# EAGLE design DACADC (EAGLE 6.2)
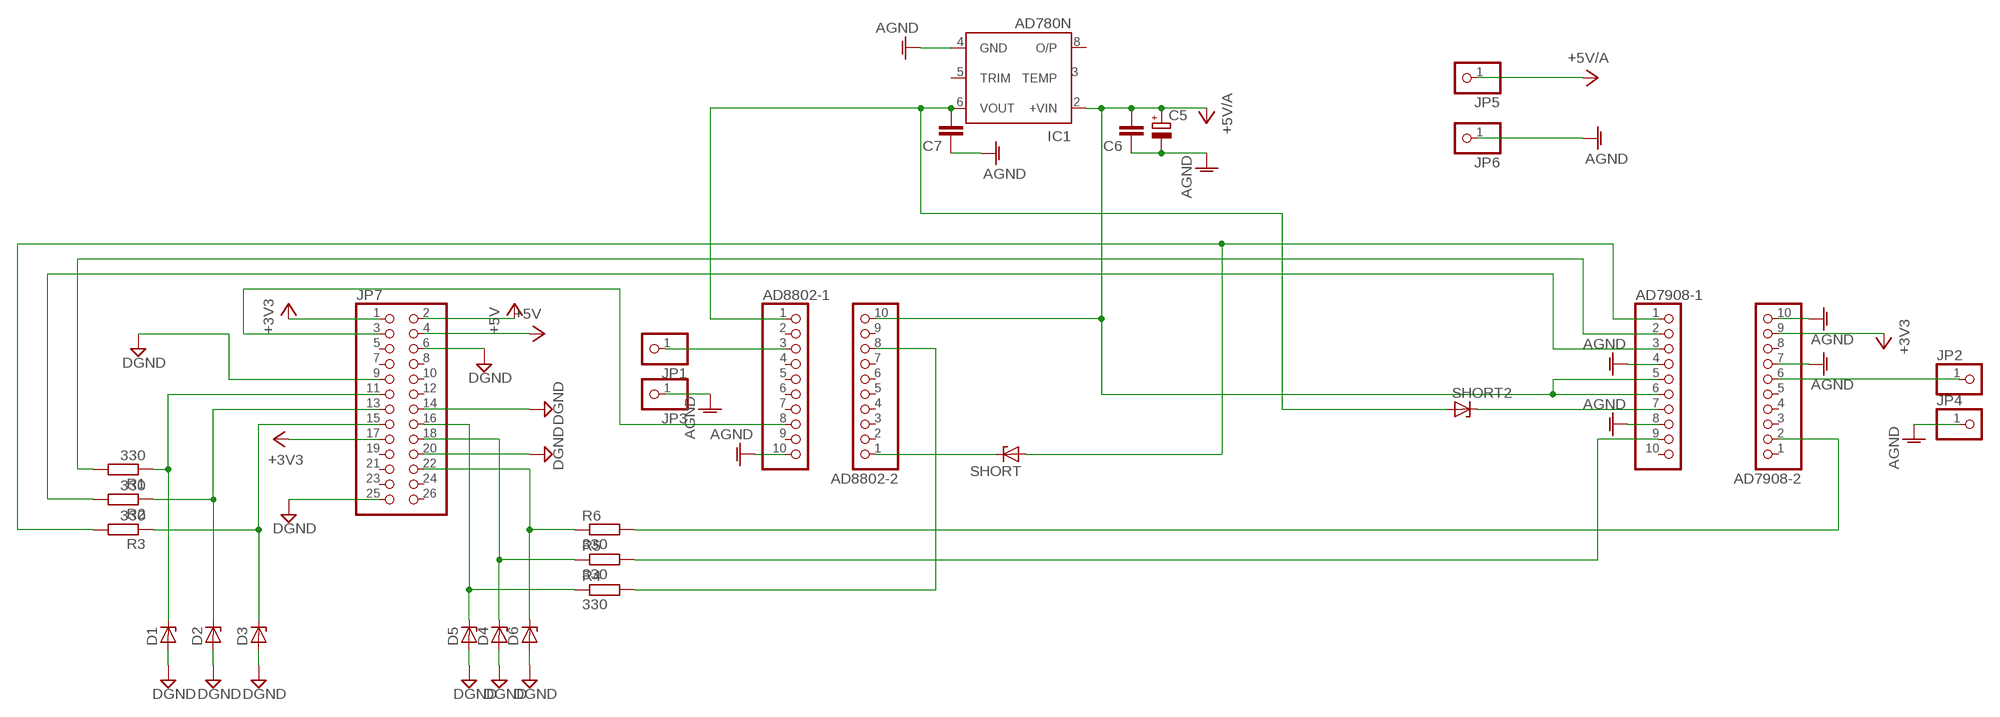
[diagram p0: schematic, sheet 1]

## Parts
AD7908-1  PINHD-1X10  [1X10]
AD7908-2  PINHD-1X10  [1X10]
AD8802-1  PINHD-1X10  [1X10]
AD8802-2  PINHD-1X10  [1X10]
C5  CPOL-EUE2.5-5  [E2,5-5]
C6  C-EU025-030X050  [C025-030X050]
C7  C-EU025-030X050  [C025-030X050]
D1  ZENER-DIODEDO34-7  [DO34Z7]
D2  ZENER-DIODEDO34-7  [DO34Z7]
D3  ZENER-DIODEDO34-7  [DO34Z7]
D4  ZENER-DIODEDO34-7  [DO34Z7]
D5  ZENER-DIODEDO34-7  [DO34Z7]
D6  ZENER-DIODEDO34-7  [DO34Z7]
IC1  AD780N  [DIL08]
JP1  PINHD-1X1  [1X01]
JP2  PINHD-1X1  [1X01]
JP3  PINHD-1X1  [1X01]
JP4  PINHD-1X1  [1X01]
JP5  PINHD-1X1  [1X01]
JP6  PINHD-1X1  [1X01]
JP7  PINHD-2X13  [2X13]
R1  330  R-EU_0204/5  [0204/5]
R2  330  R-EU_0204/5  [0204/5]
R3  330  R-EU_0204/5  [0204/5]
R4  330  R-EU_0204/5  [0204/5]
R5  330  R-EU_0204/5  [0204/5]
R6  330  R-EU_0204/5  [0204/5]
SHORT  ZENER-DIODEDO34-7  [DO34Z7]
SHORT2  ZENER-DIODEDO34-7  [DO34Z7]

## Nets
+3V3: AD7908-2.9 JP7.1 JP7.17
+5V: JP7.2 JP7.4
+5V/A: AD7908-1.5 AD7908-1.6 AD8802-2.10 C5.+ C6.2 JP5.1
AGND: AD7908-1.4 AD7908-1.8 AD7908-2.7 AD7908-2.10 AD8802-1.10 C5.- C6.1 C7.1 IC1.4(GND) JP3.1 JP4.1 JP6.1
DGND: D1.A D2.A D3.A D4.A D5.A D6.A JP7.6 JP7.9 JP7.14 JP7.20 JP7.25
N$1: D2.C JP7.13 R2.1
N$2: D3.C JP7.15 R3.1
N$3: D6.C JP7.22 R6.1
N$4: D4.C JP7.18 R5.1
N$5: D5.C JP7.16 R4.1
N$6: AD7908-1.2 R1.2
N$7: AD7908-1.7 SHORT2.C
N$8: AD7908-1.1 R3.2 SHORT.A
N$9: AD7908-1.3 R2.2
N$10: AD8802-2.8 R4.2
N$11: AD7908-1.9 R5.2
N$12: AD7908-2.2 R6.2
N$13: AD8802-1.1 C7.2 IC1.6(VOUT) SHORT2.A
N$14: AD7908-2.6 JP2.1
N$15: AD8802-1.3 JP1.1
N$16: AD8802-1.8 JP7.3
N$17: D1.C JP7.11 R1.1
N$18: AD8802-2.1 SHORT.C
Unconnected: AD7908-1.10 AD7908-2.1 AD7908-2.3 AD7908-2.4 AD7908-2.5 AD7908-2.8 AD8802-1.2 AD8802-1.4 AD8802-1.5 AD8802-1.6 AD8802-1.7 AD8802-1.9 AD8802-2.2 AD8802-2.3 AD8802-2.4 AD8802-2.5 AD8802-2.6 AD8802-2.7 AD8802-2.9 IC1.2(+VIN) IC1.3(TEMP) IC1.5(TRIM) IC1.8(O/P) JP7.5 JP7.7 JP7.8 JP7.10 JP7.12 JP7.19 JP7.21 JP7.23 JP7.24 JP7.26

## Library data of the parts
AD7908-1 AD7908-2 AD8802-1 AD8802-2 = pinhead:PINHD-1X10: PIN HEADER
C5 = rcl:CPOL-EU: POLARIZED CAPACITOR, European symbol
C6 C7 = rcl:C-EU: CAPACITOR, European symbol
D1-D6 SHORT SHORT2 = diode:ZENER-DIODE: Z-Diode
IC1 = analog-devices:AD780: High Precision Reference 2.5V/3.0V Source: http://www.analog.com/UploadedFiles/Data_Sheets/AD780.pdf; MF: ALTERA CORPORATION; MPN: AD780ANZ; OC_FARNELL: 9605550; OC_NEWARK: 59K5478
JP1-JP6 = pinhead:PINHD-1X1: PIN HEADER
JP7 = pinhead:PINHD-2X13: PIN HEADER
R1-R6 = rcl:R-EU_: RESISTOR, European symbol

## Board
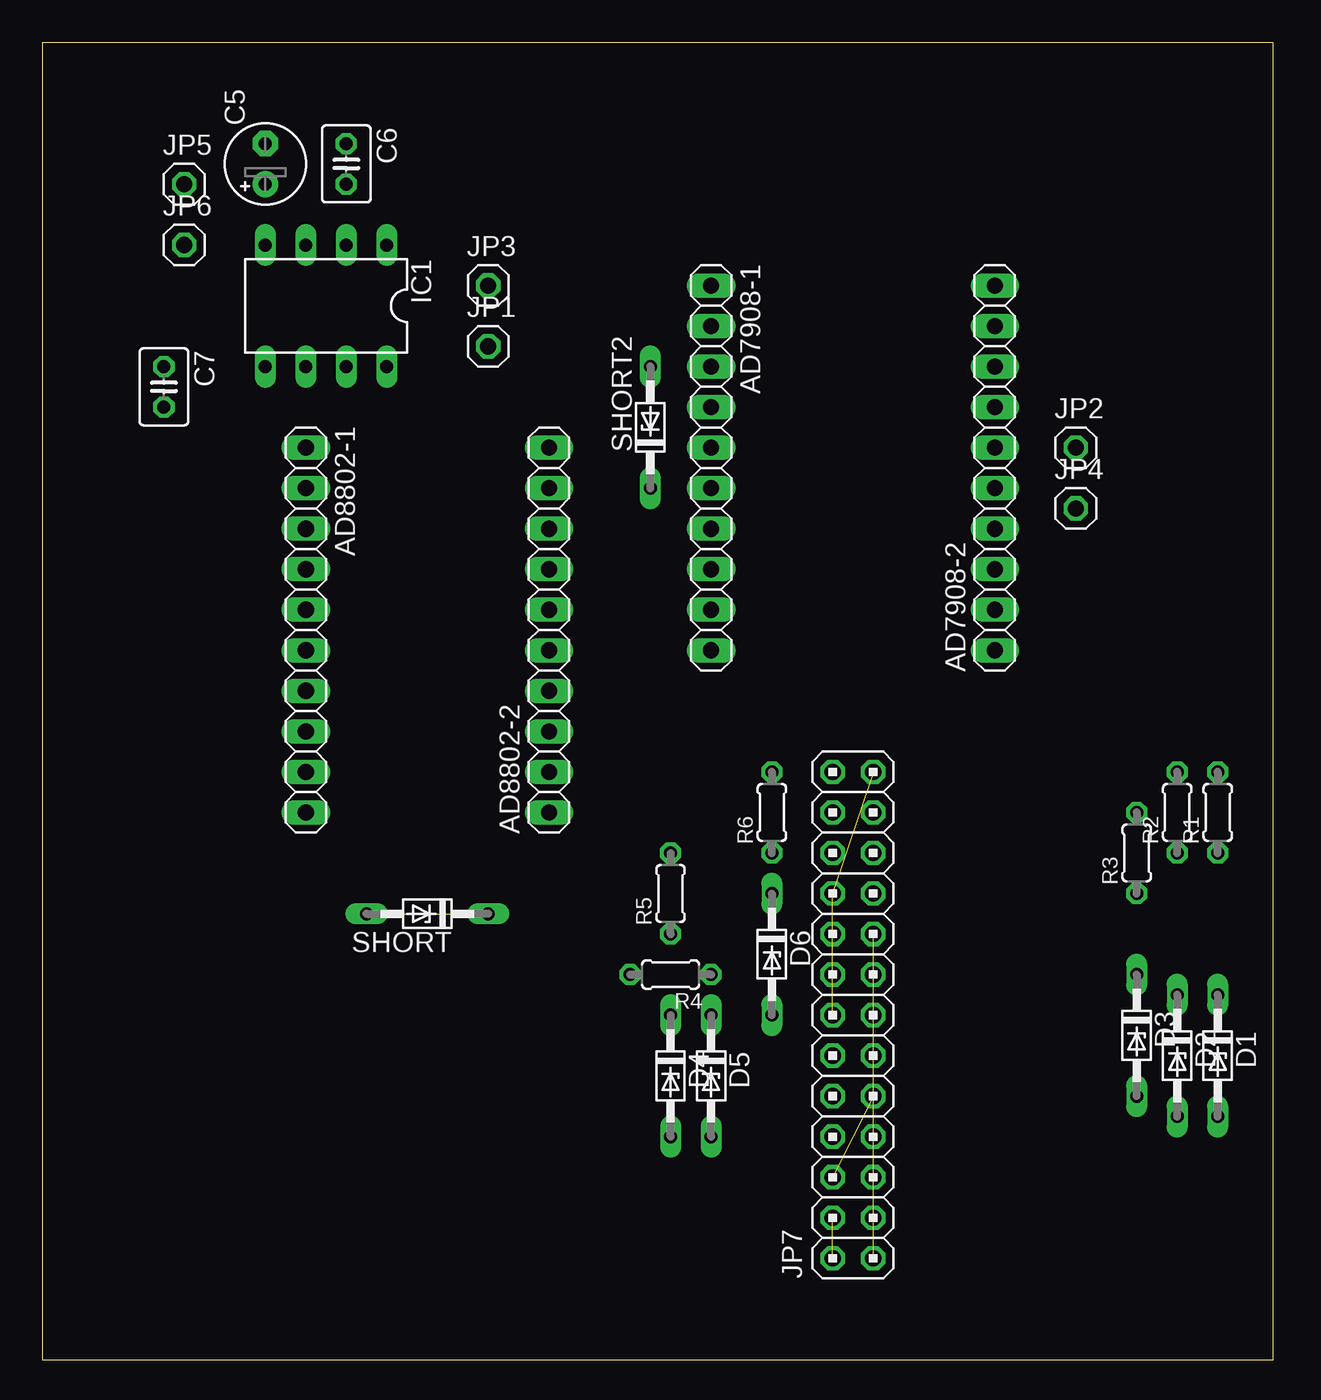
[diagram p1: board, top side]
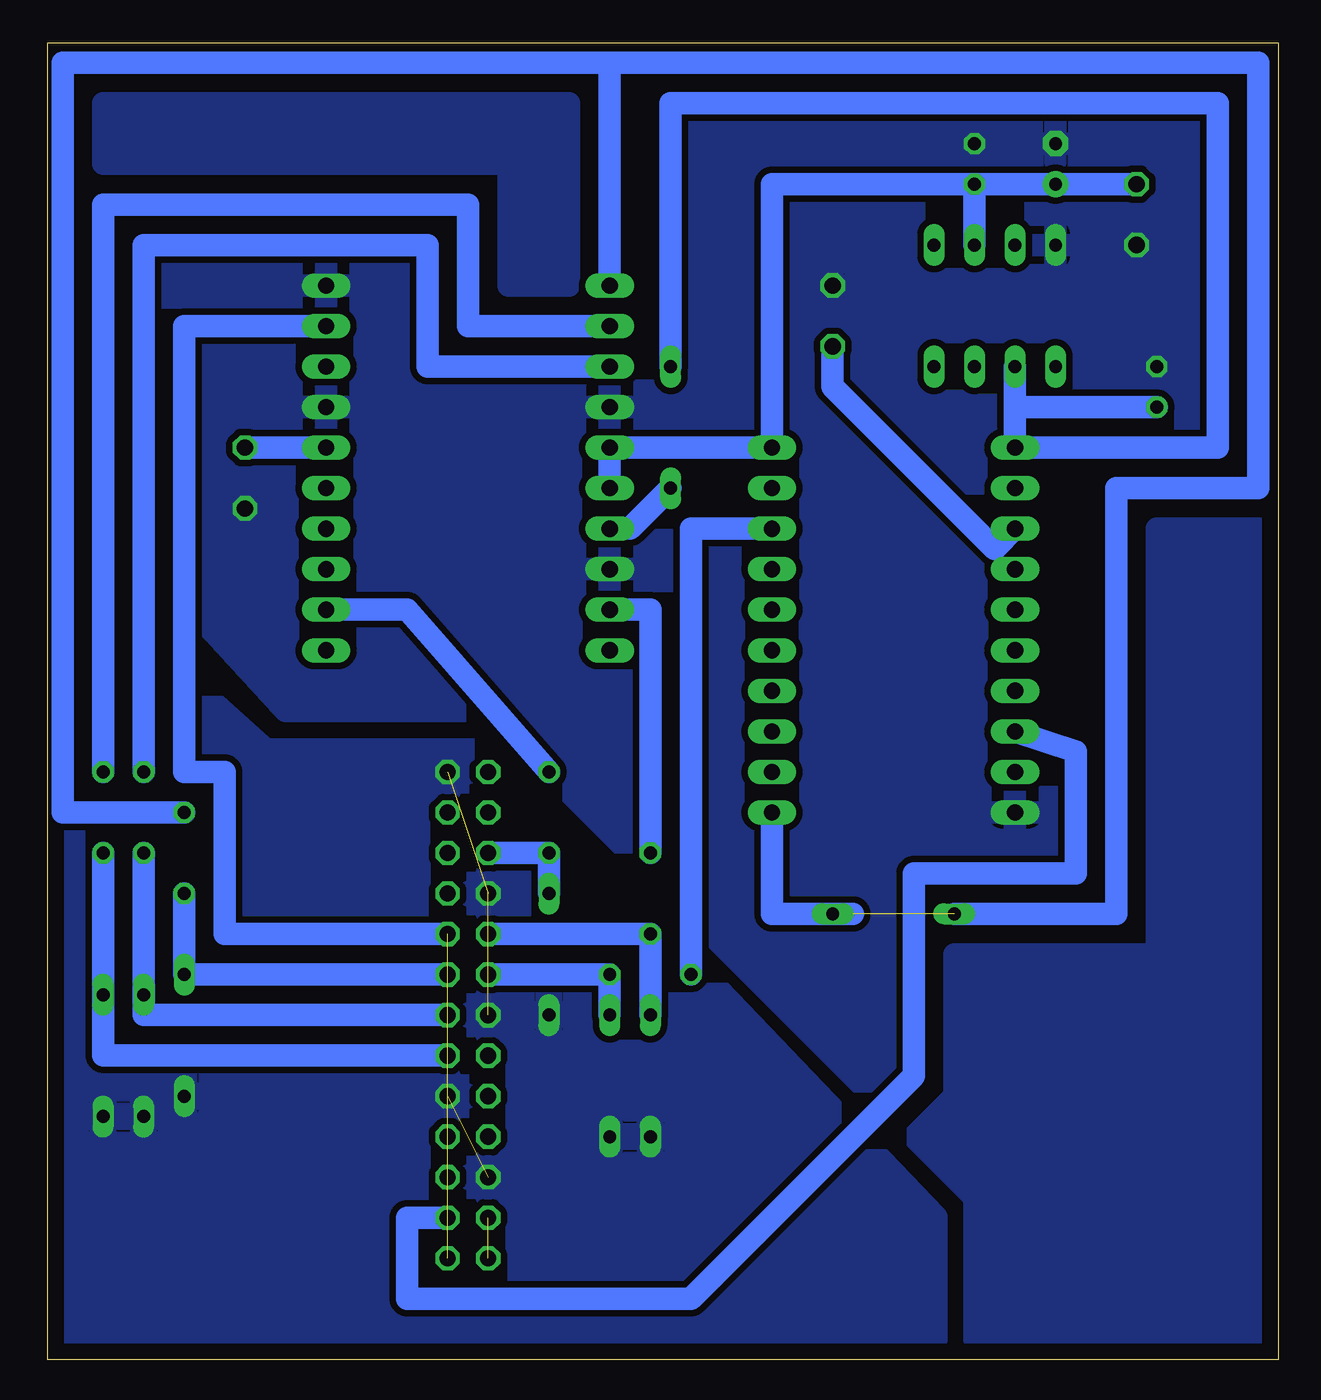
[diagram p2: board, bottom side, seen from below]

Size 77.14 x 82.54 mm. Coordinates in mm from the lower left corner, seen from the top.
Outline: 0,0 77.14,0 77.14,82.54 0,82.54 0,0
Copper layers (1*16): Top 0.035mm / dielectric 1.5mm / Bottom 0.035mm
Design rules: minimum track width 10mil, minimum drill 24mil, track to track 8mil, track to pad 8mil, pad to pad 8mil, via to via 8mil, smd to smd 8mil, copper to edge 40mil, drill to drill 8mil, minimum pad ring 10mil, minimum via ring 8mil, stop-mask expansion 4mil, vias tented up to drill 0mil, thermal gap 10mil

### Footprints (pad centres in the part's own frame; a part is rotated, then mirrored left to right if it is on the bottom)
1X10 = drill 1.016 long: 1 -11.43,0; 2 -8.89,0; 3 -6.35,0; 4 -3.81,0; 5 -1.27,0; 6 1.27,0; 7 3.81,0; 8 6.35,0; 9 8.89,0; 10 11.43,0
E2,5-5 = drill 0.813 pad 1.6: + -1.27,0 | drill 0.813 pad 1.6 octagon: - 1.27,0
C025-030X050 = drill 0.813 octagon: 1 -1.27,0; 2 1.27,0
DO34Z7 = drill 0.813 long: A 3.81,0; C -3.81,0
DIL08 = drill 0.813 long: 1 -3.81,-3.81; 2 -1.27,-3.81; 3 1.27,-3.81; 4 3.81,-3.81; 5 3.81,3.81; 6 1.27,3.81; 7 -1.27,3.81; 8 -3.81,3.81
1X01 = drill 1.016 octagon: 1 0,0
2X13 = drill 1.016 octagon: 1 -15.24,-1.27; 2 -15.24,1.27; 3 -12.7,-1.27; 4 -12.7,1.27; 5 -10.16,-1.27; 6 -10.16,1.27; 7 -7.62,-1.27; 8 -7.62,1.27; 9 -5.08,-1.27; 10 -5.08,1.27; 11 -2.54,-1.27; 12 -2.54,1.27; 13 0,-1.27; 14 0,1.27; 15 2.54,-1.27; 16 2.54,1.27; 17 5.08,-1.27; 18 5.08,1.27; 19 7.62,-1.27; 20 7.62,1.27; 21 10.16,-1.27; 22 10.16,1.27; 23 12.7,-1.27; 24 12.7,1.27; 25 15.24,-1.27; 26 15.24,1.27
0204/5 = drill 0.813 octagon: 1 -2.54,0; 2 2.54,0

### Placement (x,y rotation side)
AD7908-1  41.91,55.88 270 top
AD7908-2  59.69,55.88 90 top
AD8802-1  16.51,45.72 270 top
AD8802-2  31.75,45.72 90 top
C5  13.97,74.93 90 top
C6  19.05,74.93 270 top
C7  7.62,60.96 270 top
D1  73.66,19.05 270 top
D2  71.12,19.05 270 top
D3  68.58,20.32 270 top
D4  39.37,17.78 270 top
D5  41.91,17.78 270 top
D6  45.72,25.4 270 top
IC1  17.78,66.04 180 top
JP1  27.94,63.5 0 top
JP2  64.77,57.15 0 top
JP3  27.94,67.31 0 top
JP4  64.77,53.34 0 top
JP5  8.89,73.66 0 top
JP6  8.89,69.85 0 top
JP7  50.8,21.59 90 top
R1  73.66,34.29 90 top
R2  71.12,34.29 90 top
R3  68.58,31.75 90 top
R4  39.37,24.13 180 top
R5  39.37,29.21 90 top
R6  45.72,34.29 90 top
SHORT  24.13,27.94 180 top
SHORT2  38.1,58.42 90 top

### Tracks (layer width: path | path; a pad name or v marks a point on that pad's centre or on a via)
+3V3  (1 unrouted)
  Bottom 1.422: AD7908-2.9 68.58,64.77 68.58,36.83 66.04,36.83 66.04,26.67 JP7.17
+5V  (1 unrouted)
+5V/A
  Bottom 1.422: AD7908-1.6 AD7908-1.5 AD8802-2.10 31.75,73.66 C6.2 | JP5.1 C5.+ C6.2 | 19.05,69.85 C6.2
AGND
  pour Bottom (isolate 0.406): 76.2,80.01 76.2,55.88 62.23,40.64 49.53,40.64 19.05,10.16 19.05,1.27 1.27,1.27 1.27,80.01
DGND  (3 unrouted)
  pour Bottom (isolate 0.406): 76.2,49.53 63.5,38.1 49.53,38.1 21.59,8.89 21.59,1.27 76.2,1.27
N$1
  Bottom 1.422: JP7.13 71.12,21.59 D2.C R2.1
N$2
  Bottom 1.422: JP7.15 D3.C R3.1
N$3
  Bottom 1.422: JP7.22 R6.1 D6.C
N$4
  Bottom 1.422: JP7.18 R5.1 D4.C
N$5
  Bottom 1.422: D5.C R4.1 JP7.16
N$6
  Bottom 1.422: R1.2 73.66,72.39 50.8,72.39 50.8,64.77 AD7908-1.2
N$7
  Bottom 1.422: SHORT2.C 40.64,52.07 AD7908-1.7
N$8  (1 unrouted)
  Bottom 1.422: R3.2 76.2,34.29 76.2,81.28 41.91,81.28 | 41.91,81.28 AD7908-1.1 | 41.91,81.28 1.27,81.28 1.27,54.61 10.16,54.61 10.16,27.94 SHORT.A | 31.75,33.02 31.75,27.94 26.67,27.94
N$9
  Bottom 1.422: R2.2 71.12,69.85 53.34,69.85 53.34,62.23 AD7908-1.3
N$10
  Bottom 1.422: R4.2 36.83,52.07 AD8802-2.8
N$11
  Bottom 1.422: R5.2 39.37,46.99 AD7908-1.9
N$12
  Bottom 1.422: R6.2 54.61,46.99 AD7908-2.2
N$13
  Bottom 1.422: IC1.6 16.51,59.69 | C7.2 16.51,59.69 | 16.51,59.69 AD8802-1.1 3.81,57.15 3.81,78.74 38.1,78.74 SHORT2.A
N$14
  Bottom 1.422: JP2.1 AD7908-2.6
N$15
  Bottom 1.422: JP1.1 27.94,60.96 17.78,50.8 AD8802-1.3
N$16
  Bottom 1.422: JP7.3 54.61,8.89 54.61,3.81 36.83,3.81 22.86,17.78 22.86,30.48 12.7,30.48 12.7,38.1 AD8802-1.8
N$17
  Bottom 1.422: D1.C R1.1 73.66,19.05 JP7.11
N$18
  Bottom 1.422: SHORT.C 31.75,27.94 AD8802-2.1
N$19
  pour Bottom (isolate 0.406): 1.27,52.07 7.62,52.07 7.62,25.4 20.32,25.4 20.32,16.51 22.86,13.97 19.05,10.16 19.05,1.27 1.27,1.27
N$20
  pour Bottom (isolate 0.406): 44.45,78.74 44.45,67.31 48.26,67.31 48.26,74.93 73.66,74.93 73.66,78.74